# Altium project PCB_Project.PrjPcb
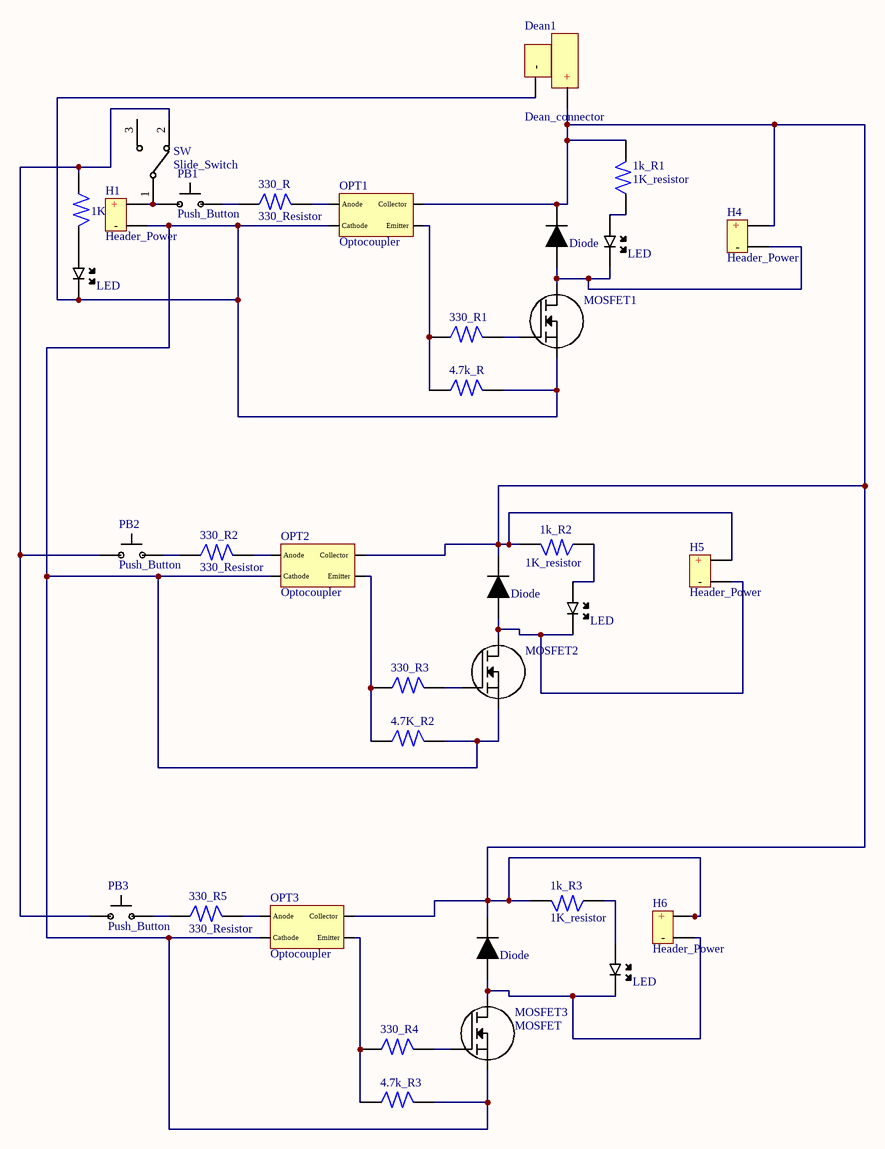
[diagram p0: Sheet2.SchDoc]
1 sheet, 35 parts. Net scope: global (net labels, ports and power ports of the same name join across sheets).
Board file: PCB2.PcbDoc

## Sheet Sheet2.SchDoc
size 381 x 241 mm; SheetNumber: 1; SheetTotal: 1

### Parts
1k_R1  1K_resistor  [1k_resistor]
1k_R2  1K_resistor  [1k_resistor]
1k_R3  1K_resistor  [1k_resistor]
1k_RLED  1K  [1k_resistor]
4.7k_R  4.7k_Resistor  [4.7k_resistor]  (value not drawn)
4.7K_R2  4.7k_Resistor  [4.7k_resistor]  (value not drawn)
4.7k_R3  4.7k_Resistor  [4.7k_resistor]  (value not drawn)
330_R  330_Resistor  [330_resistor]
330_R1  330_Resistor  [330_resistor]  (value not drawn)
330_R2  330_Resistor  [330_resistor]
330_R3  330_Resistor  [330_resistor]  (value not drawn)
330_R4  330_Resistor  [330_resistor]  (value not drawn)
330_R5  330_Resistor  [330_resistor]
D1  Diode  [Diode]
D2  Diode  [Diode]
D3  Diode  [Diode]
Dean1  Dean_connector  [Dean_connector]
H1  Header_Power  [2_pinHeader]
H4  Header_Power  [2_pinHeader]
H5  Header_Power  [2_pinHeader]
H6  Header_Power  [2_pinHeader]
LED1  LED  [LED]
LED2  LED  [LED]
LED3  LED  [LED]
LEDp  LED  [LED]
MOSFET1  MOSFET  [MOSFET_IR540N]  (value not drawn)
MOSFET2  MOSFET  [MOSFET_IR540N]  (value not drawn)
MOSFET3  MOSFET  [MOSFET_IR540N]
OPT1  Optocoupler  [optocoupler]
OPT2  Optocoupler  [optocoupler]
OPT3  Optocoupler  [optocoupler]
PB1  Push_Button  [push_button]
PB2  Push_Button  [push_button]
PB3  Push_Button  [push_button]
SW  Slide_Switch  [Slide_switch]

### Nets
Net1k_R1_1: 1k_R1.1 LED1.2(Cathode)
Net1k_R1_2: 1k_R1.2 1k_R2.2 1k_R3.2 D1.2(-) D2.2(-) D3.2(-) Dean1.2(+) H4.1(+) H5.1(+) H6.1(+) OPT1.4(Collector) OPT2.4(Collector) OPT3.4(Collector)
Net1k_R2_1: 1k_R2.1 LED2.2(Cathode)
Net1k_R3_1: 1k_R3.1 LED3.2(Cathode)
Net1k_RLED_1: 1k_RLED.1 PB2.1 PB3.1 SW.2
Net1k_RLED_2: 1k_RLED.2 LEDp.2(Cathode)
Net4.7K_R2_1: 4.7K_R2.1 330_R3.1 OPT2.3(Emitter)
Net4.7k_R3_1: 4.7k_R3.1 330_R4.1 OPT3.3(Emitter)
Net4.7k_R_1: 4.7k_R.1 330_R1.1 OPT1.3(Emitter)
Net4.7k_R_2: 4.7k_R.2 4.7K_R2.2 4.7k_R3.2 Dean1.1(-) H1.2(-) LEDp.1(Anode) MOSFET1.3(Source) MOSFET2.3(Source) MOSFET3.3(Source) OPT1.2(Cathode) OPT2.2(Cathode) OPT3.2(Cathode)
Net330_R1_2: 330_R1.2 MOSFET1.1(Gate)
Net330_R2_1: 330_R2.1 PB2.2
Net330_R2_2: 330_R2.2 OPT2.1(Anode)
Net330_R3_2: 330_R3.2 MOSFET2.1(Gate)
Net330_R4_2: 330_R4.2 MOSFET3.1(Gate)
Net330_R5_1: 330_R5.1 PB3.2
Net330_R5_2: 330_R5.2 OPT3.1(Anode)
Net330_R_1: 330_R.1 PB1.2
Net330_R_2: 330_R.2 OPT1.1(Anode)
NetD1_1: D1.1(+) H4.2(-) LED1.1(Anode) MOSFET1.2(Drain)
NetD2_1: D2.1(+) H5.2(-) LED2.1(Anode) MOSFET2.2(Drain)
NetD3_1: D3.1(+) H6.2(-) LED3.1(Anode) MOSFET3.2(Drain)
NetH1_1: H1.1(+) PB1.1 SW.1

Not connected (* = marked no-connect by the designer): SW 3

### Library data of the parts
1k_RLED = 1K_resistor